# EAGLE design Cargador_RasPi3HAT_CamSlot_v1.3 (EAGLE 9.3.0)
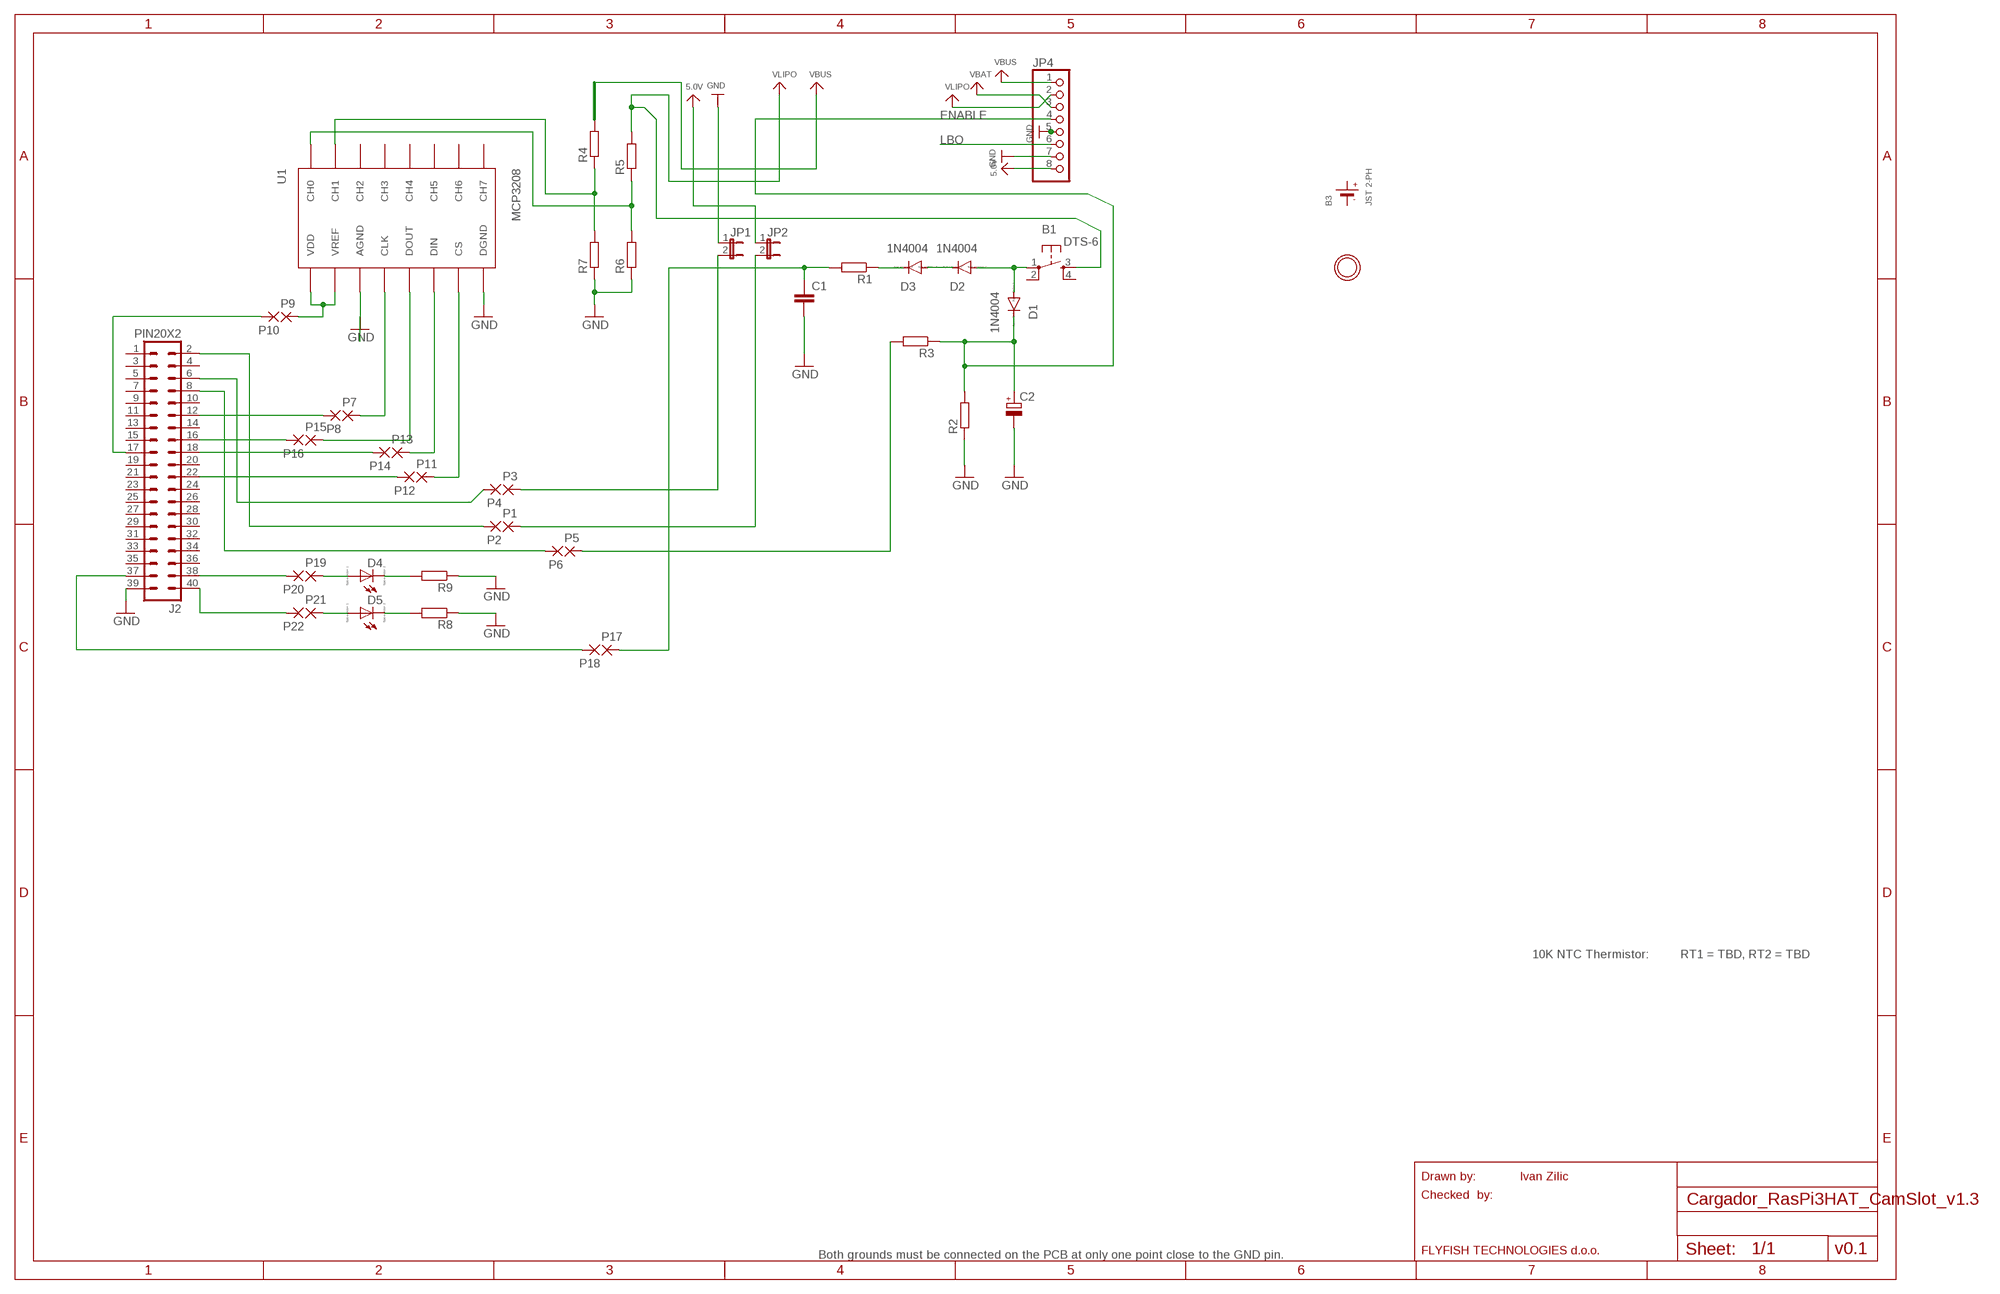
[diagram p0: schematic, sheet 1]

## Parts
B1  DTS-6  [DTS-6]
B3  JST 2-PH  BATTERY  [JSTPH2]
C1  C2.5/2  [C2.5-2]
C2  CPOL-EUE5-4  [E5-4]
D1  1N4004  [DO41-10]
D2  1N4004  [DO41-10]
D3  1N4004  [DO41-10]
D4  LED_ELD260  [LED_LD260]
D5  LED_ELD260  [LED_LD260]
J2  PIN20X2  [PIN_20X2]
JP1  JP1E  [JP1]
JP2  JP1E  [JP1]
JP4  HEADER-1X8  [1X08_OVAL]
P1  2,15/1,0  [2,15/1,0]
P2  2,15/1,0  [2,15/1,0]
P3  2,15/1,0  [2,15/1,0]
P4  2,15/1,0  [2,15/1,0]
P5  2,15/1,0  [2,15/1,0]
P6  2,15/1,0  [2,15/1,0]
P7  2,15/1,0  [2,15/1,0]
P8  2,15/1,0  [2,15/1,0]
P9  2,15/1,0  [2,15/1,0]
P10  2,15/1,0  [2,15/1,0]
P11  2,15/1,0  [2,15/1,0]
P12  2,15/1,0  [2,15/1,0]
P13  2,15/1,0  [2,15/1,0]
P14  2,15/1,0  [2,15/1,0]
P15  2,15/1,0  [2,15/1,0]
P16  2,15/1,0  [2,15/1,0]
P17  2,15/1,0  [2,15/1,0]
P18  2,15/1,0  [2,15/1,0]
P19  2,15/1,0  [2,15/1,0]
P20  2,15/1,0  [2,15/1,0]
P21  2,15/1,0  [2,15/1,0]
P22  2,15/1,0  [2,15/1,0]
R1  R-EU_0207/10  [0207/10]
R2  R-EU_0207/10  [0207/10]
R3  R-EU_0207/10  [0207/10]
R4  R-EU_0207/10  [0207/10]
R5  R-EU_0207/10  [0207/10]
R6  R-EU_0207/10  [0207/10]
R7  R-EU_0207/10  [0207/10]
R8  R-EU_0207/10  [0207/10]
R9  R-EU_0207/10  [0207/10]
U1  MCP3208  [DIL16]
U$5  MOUNTINGHOLE2.5  [MOUNTINGHOLE_2.5_PLATED]

## Nets
5.0V: JP2.1 JP4.8
ENABLE: C2.+ D1.C JP4.4 R2.2 R3.1
GND [GND]: C1.2 C2.- J2.39 JP1.1 JP4.5 JP4.7 R2.1 R6.1 R7.1 R8.1 R9.1 U1.AGND U1.DGND
LBO: JP4.6
N$1: JP1.2 P3.1(P)
N$2: P5.1(P) R3.2
N$3: D4.K(C) R9.2
N$4: D5.K(C) R8.2
N$5: D3.C R1.1
N$6: J2.40 P22.1(P)
N$7: J2.38 P20.1(P)
N$8: P11.1(P) U1.CS
N$9: P15.1(P) U1.DOUT
N$10: P13.1(P) U1.DIN
N$11 [GND]: P7.1(P) U1.CLK
N$12: J2.17 P10.1(P)
N$13 [GND]: R4.1 R7.2 U1.CH1
N$14: R5.1 R6.2 U1.CH0
N$15: J2.2 P2.1(P)
N$16: J2.6 P4.1(P)
N$17: J2.8 P6.1(P)
N$18: J2.12 P8.1(P)
N$19: P9.1(P) U1.VDD U1.VREF
N$20: JP2.2 P1.1(P)
N$21: C1.1 P17.1(P) R1.2
N$22: J2.22 P12.1(P)
N$23: D2.C D3.A
N$24 [GND]: B1.1 D1.A D2.A
N$25: J2.18 P14.1(P)
N$26: J2.16 P16.1(P)
N$27: J2.37 P18.1(P)
N$28: D4.A P19.1(P)
N$29: D5.A P21.1(P)
VBAT: JP4.3
VBUS: JP4.1 R4.2
VLIPO: B1.3 JP4.2 R5.2
Unconnected: B1.2 B1.4 B3.1(-) B3.2(+) J2.1 J2.3 J2.4 J2.5 J2.7 J2.9 J2.10 J2.11 J2.13 J2.14 J2.15 J2.19 J2.20 J2.21 J2.23 J2.24 J2.25 J2.26 J2.27 J2.28 J2.29 J2.30 J2.31 J2.32 J2.33 J2.34 J2.35 J2.36 U1.CH2 U1.CH3 U1.CH4 U1.CH5 U1.CH6 U1.CH7

## Notes on the sheet
- 10K NTC Thermistor: | RT1 = TBD, RT2 = TBD
- Drawn by: | Ivan Zilic
- Checked  by:
- Both grounds must be connected on the PCB at only one point close to the GND pin. | FLYFISH TECHNOLOGIES d.o.o. | v0.1

## Library data of the parts
B1 = switch-tact:DTS-6
B3 = microbuilder:BATTERY: CR1220 SMT - Digikey: 3001K-ND CD2032 BAT-HLD-001 - Digikey: BAT-HLD-001-ND
C1 = capacitor-wima:C: CAPACITOR naming: grid - package width
C2 = rcl:CPOL-EU: POLARIZED CAPACITOR, European symbol; SPICEPREFIX: C
D1-D3 = diode:1N4004: DIODE general purpose rectifier, 1 A
D4 D5 = eagle-ltspice:LED_E: LED Source: http://www.osram.convergy.de Source: www.luxeon.com Source: www.kingbright.com; SPICEMODEL: NONE; SPICEPREFIX: D; SPICETYPE: diode
J2 = FLYFISH:PIN20X2
JP1 JP2 = jumper:JP1E: JUMPER
JP4 = microbuilder:HEADER-1X8: PIN HEADER
P1-P22 = wirepad:2,15/1,0: THROUGH-HOLE PAD
R1-R9 = rcl:R-EU_: RESISTOR, European symbol; SPICEPREFIX: R
U1 = mcp3208:MCP3208
U$5 = microbuilder:MOUNTINGHOLE: Mounting Hole For #2 screws (0.086"/2.18mm width, 0.094"/2.4mm hole) use 2.5mm

## Net classes
1 GND: width 0.254 mm, clearance 0.381 mm

## Board
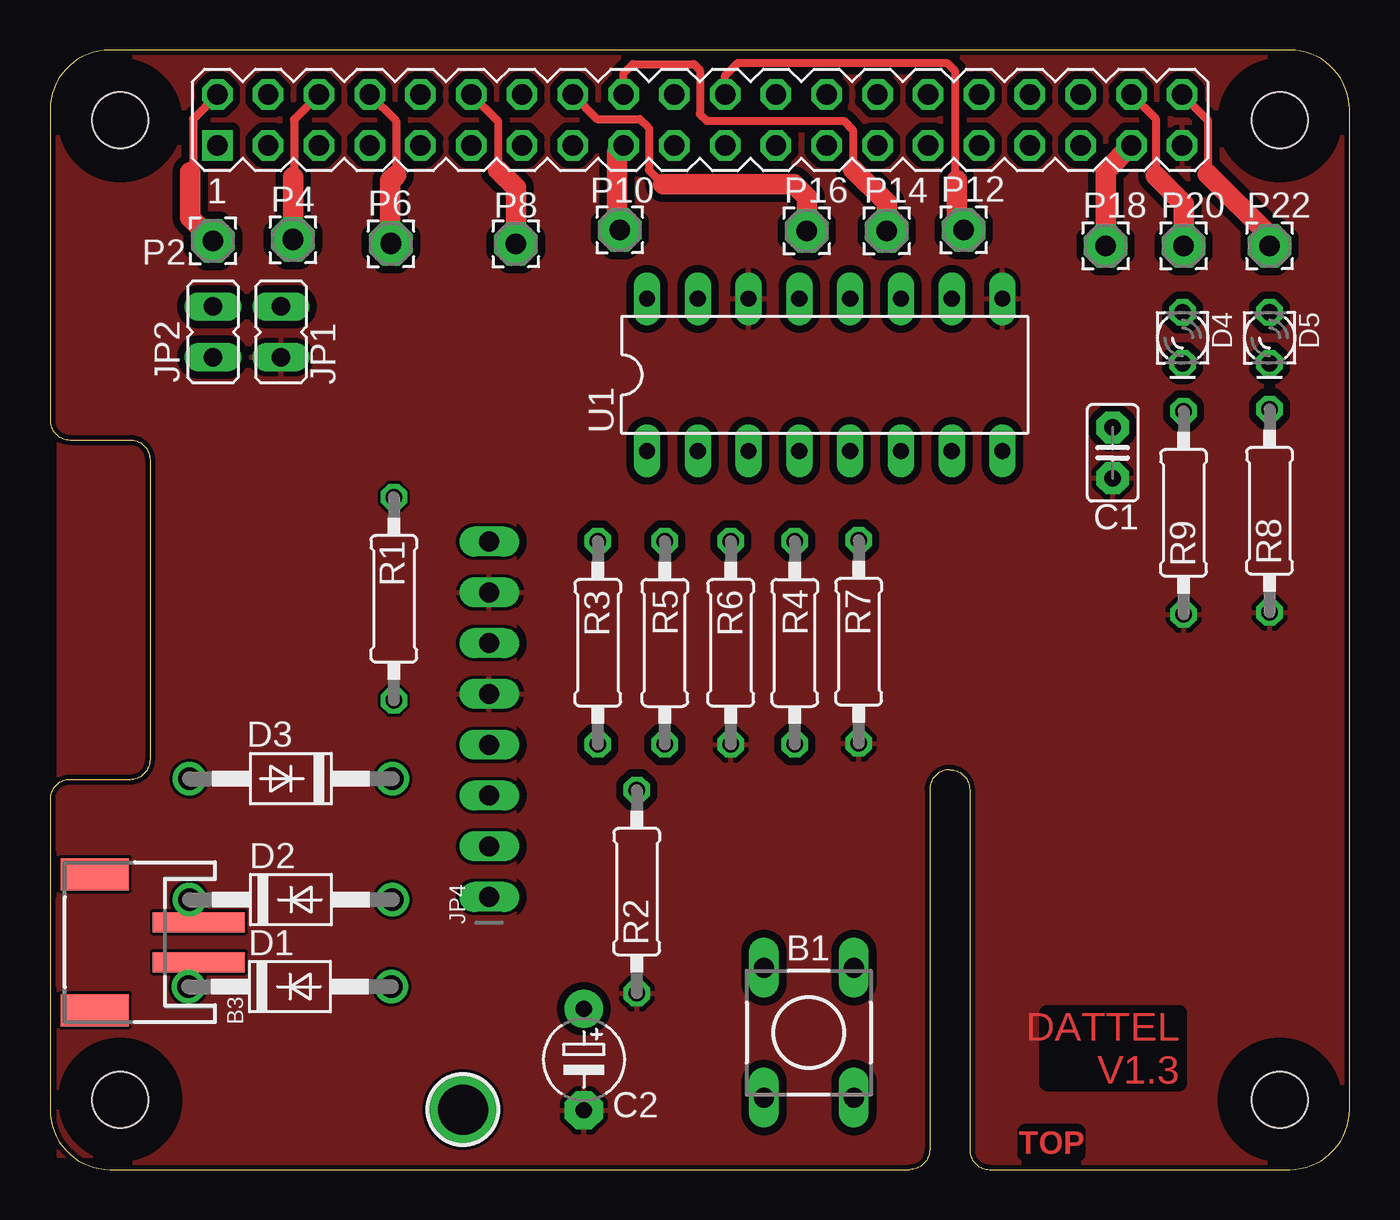
[diagram p1: board, top side]
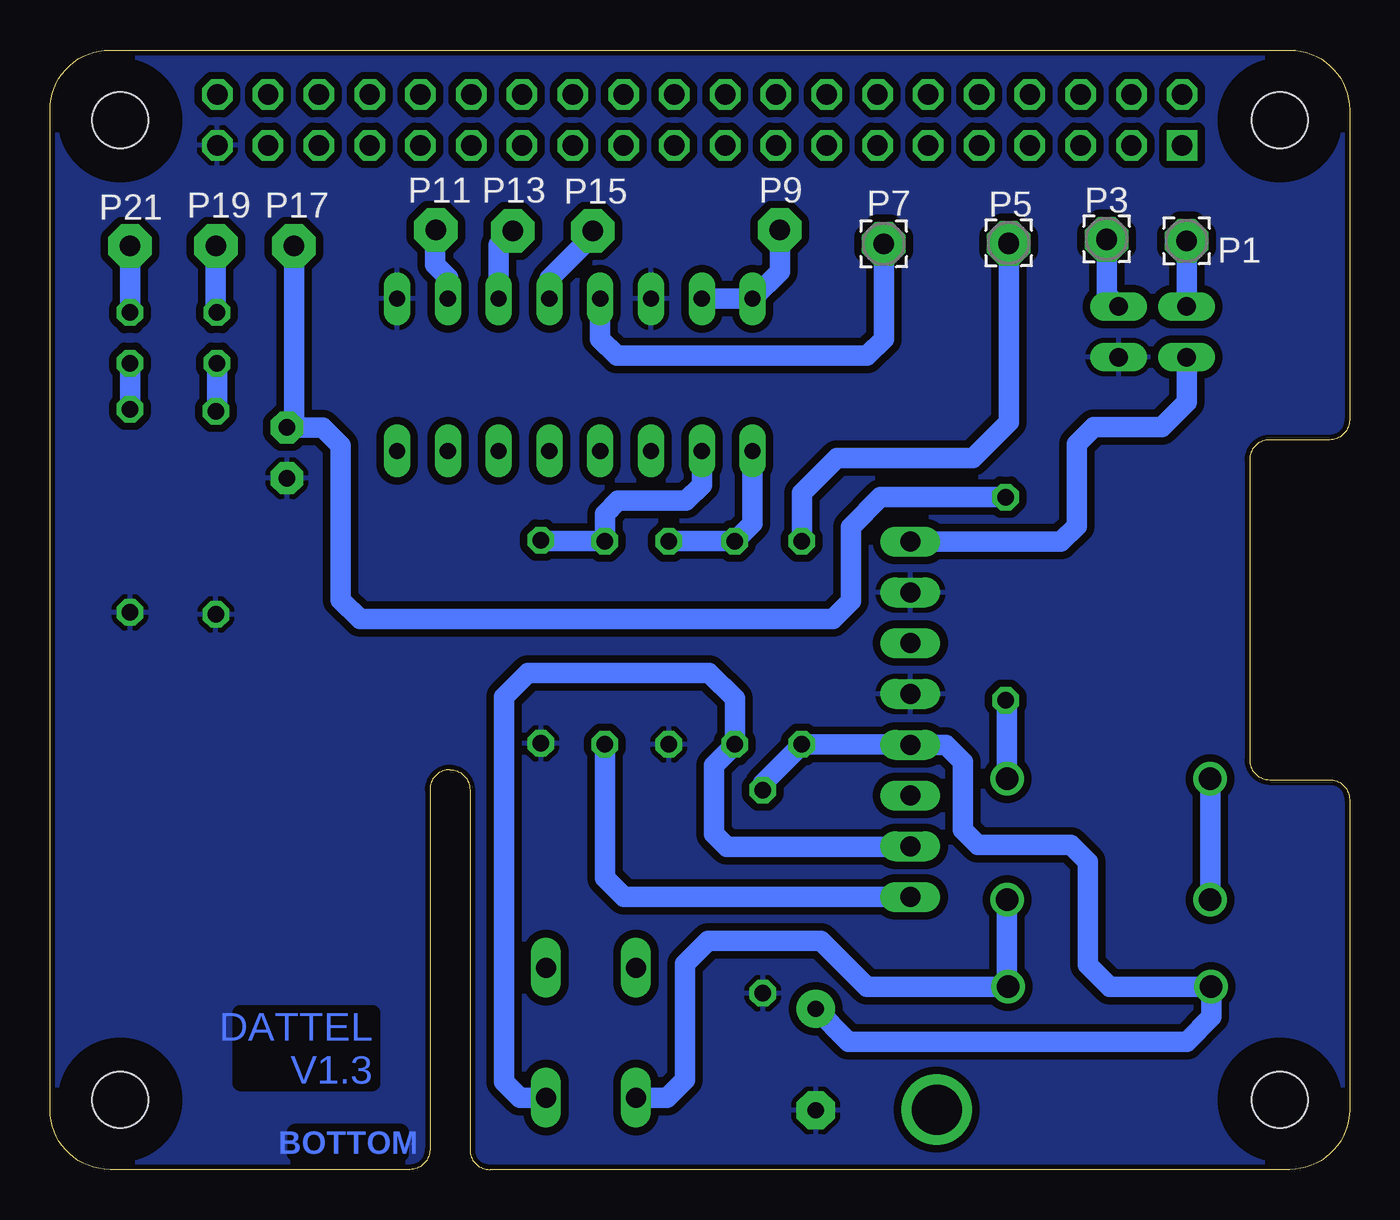
[diagram p2: board, bottom side, seen from below]

Size 65 x 56 mm. Coordinates in mm from the lower left corner, seen from the top.
Outline: 0,3 arc90 3,0 43,0 arc90 44,1 44,19 arc-90 45,20 arc-90 46,19 46,1 arc90 47,0 62,0 arc90 65,3 65,53 arc90 62,56 3,56 arc90 0,53 0,37.5 arc90 1,36.5 4,36.5 arc-90 5,35.5 5,20.5 arc-90 4,19.5 1,19.5 arc90 0,18.5 0,3
Copper layers (1*16): Top 0.035mm / dielectric 1.5mm / Bottom 0.035mm
Design rules "ITEADstudio_DRC": minimum track width 6mil, minimum drill 12mil, track to track 6mil, track to pad 6mil, pad to pad 6mil, via to via 6mil, smd to smd 0mil, copper to edge 10mil, drill to drill 10mil, minimum pad ring 10mil, minimum via ring 6mil, stop-mask expansion 2mil, vias tented up to drill 100mil, thermal gap 10mil
Holes 2.8 mm at 3.5,3.5 3.5,52.5 61.5,52.5 61.5,3.5
tRestrict: area 1.9,51 to 5,54; area 60,51 to 63,54; area 60,1.9 to 63,5; area 1.9,1.9 to 5,5
bRestrict: area 1.9,1.9 to 5,5; area 1.9,51 to 5,54; area 60,1.9 to 63,5; area 60,51 to 63,54

### Footprints (pad centres in the part's own frame; a part is rotated, then mirrored left to right if it is on the bottom)
DTS-6 = drill 1 long: 1 -3.25,2.25; 2 3.25,2.25; 3 -3.25,-2.25; 4 3.25,-2.25
JSTPH2 = smd 1 x 4.6: 1 -1,-3.7; 2 1,-3.7 | smd 1.6 x 3.4: NC1 -3.4,1.5; NC2 3.4,1.5
C2.5-2 = drill 0.813 pad 1.6 octagon: 1 -1.27,0; 2 1.27,0
E5-4 = drill 0.813 pad 1.905: + -2.54,0 | drill 0.813 pad 1.905 octagon: - 2.54,0
DO41-10 = drill 1.118: A 5.08,0; C -5.08,0
LED_LD260 = drill 0.813 octagon: A -1.27,0; K 1.27,0
PIN_20X2 = drill 1.016 square: 1 -24.13,-1.27 | drill 1.016 octagon: 2 -24.13,1.27; 3 -21.59,-1.27; 4 -21.59,1.27; 5 -19.05,-1.27; 6 -19.05,1.27; 7 -16.51,-1.27; 8 -16.51,1.27; 9 -13.97,-1.27; 10 -13.97,1.27; 11 -11.43,-1.27; 12 -11.43,1.27; 13 -8.89,-1.27; 14 -8.89,1.27; 15 -6.35,-1.27; 16 -6.35,1.27; 17 -3.81,-1.27; 18 -3.81,1.27; 19 -1.27,-1.27; 20 -1.27,1.27; 21 1.27,-1.27; 22 1.27,1.27; 23 3.81,-1.27; 24 3.81,1.27; 25 6.35,-1.27; 26 6.35,1.27; 27 8.89,-1.27; 28 8.89,1.27; 29 11.43,-1.27; 30 11.43,1.27; 31 13.97,-1.27; 32 13.97,1.27; 33 16.51,-1.27; 34 16.51,1.27; 35 19.05,-1.27; 36 19.05,1.27; 37 21.59,-1.27; 38 21.59,1.27; 39 24.13,-1.27; 40 24.13,1.27
JP1 = drill 0.914 long: 1 0,-1.27; 2 0,1.27
1X08_OVAL = drill 1 long: 1 -8.89,0; 2 -6.35,0; 3 -3.81,0; 4 -1.27,0; 5 1.27,0; 6 3.81,0; 7 6.35,0; 8 8.89,0
2,15/1,0 = drill 1.016 pad 2.159 octagon: 1 0,0
0207/10 = drill 0.813 octagon: 1 -5.08,0; 2 5.08,0
DIL16 = drill 0.813 long: AGND -3.81,3.81; CH0 -8.89,-3.81; CH1 -6.35,-3.81; CH2 -3.81,-3.81; CH3 -1.27,-3.81; CH4 1.27,-3.81; CH5 3.81,-3.81; CH6 6.35,-3.81; CH7 8.89,-3.81; CLK -1.27,3.81; CS 6.35,3.81; DGND 8.89,3.81; DIN 3.81,3.81; DOUT 1.27,3.81; VDD -8.89,3.81; VREF -6.35,3.81
MOUNTINGHOLE_2.5_PLATED = drill 2.5 pad 3.2: P$1 0,0

### Placement (x,y rotation side)
B1  37.95,6.85 90 top
B3  3.74,11.37 90 top
C1  53.15,35.85 270 top
C2  26.7,5.5 270 top
D1  12,9.15 0 top
D2  12.05,13.5 0 top
D3  12.05,19.55 180 top
D4  56.65,41.6 270 top
D5  61,41.6 270 top
J2  32.5,52.5 0 top
JP1  11.55,41.9 0 top
JP2  8.15,41.9 0 top
JP4  21.97,22.52 90 top
P1  8.15,46.45 0 top
P2  8.15,46.45 0 bottom
P3  12.15,46.5 0 top
P4  12.15,46.55 0 bottom
P5  17.05,46.3 0 top
P6  17.05,46.35 0 bottom
P7  23.3,46.3 0 top
P8  23.3,46.3 0 bottom
P9  28.5,47 0 top
P10  28.5,47 0 top
P11  45.7,47 0 top
P12  45.7,47 0 top
P13  41.85,46.95 0 top
P14  41.85,46.95 0 top
P15  37.85,46.95 0 top
P16  37.85,46.95 0 top
P17  52.8,46.2 0 top
P18  52.8,46.2 0 top
P19  56.7,46.2 0 top
P20  56.7,46.2 0 top
P21  61,46.2 0 top
P22  61,46.2 0 top
R1  17.2,28.55 90 top
R2  29.35,13.9 90 top
R3  27.4,26.35 90 top
R4  37.25,26.35 270 top
R5  30.75,26.35 270 top
R6  34.05,26.35 90 top
R7  40.45,26.4 90 top
R8  61,32.95 90 top
R9  56.7,32.85 90 top
U1  38.75,39.75 0 top
U$5  20.65,3 0 top

### Tracks (layer width: path | path; a pad name or v marks a point on that pad's centre or on a via)
5.0V
  Bottom 1.016: JP2.1 8.15,38.4 9.4,37.15 12.8,37.15 13.65,36.3 13.65,32.2 14.44,31.41 JP4.8
BOOSTER
  pour Top: 0.4,36.97 23.26,36.97 23.26,0.65 0.4,0.65
ENABLE
  Bottom 0.152: 22.03,21.27 21.99,21.23
  Bottom 0.254: 21.99,21.23 JP4.4
  Bottom 1.016: C2.+ 25.06,6.4 8.15,6.4 6.92,7.63 D1.C 12,9.15 13.1,10.25 13.1,15.4 13.95,16.25 18.6,16.25 19.35,17 19.35,20.4 20.18,21.23 21.99,21.23 | R2.2 29.35,19.32 R3.1 22.03,21.27
GND
  pour Bottom: 0,3 arc90 3,0 43,0 arc90 44,1 44,19 arc-90 45,20 arc-90 46,19 46,1 arc90 47,0 62,0 arc90 65,3 65,53 arc90 62,56 3,56 arc90 0,53 0,37.5 arc90 1,36.5 4,36.5 arc-90 5,35.5 5,20.5 arc-90 4,19.5 1,19.5 arc90 0,18.5
  pour Top: 0,3 arc90 3,0 43,0 arc90 44,1 44,19 arc-90 45,20 arc-90 46,19 46,1 arc90 47,0 62,0 arc90 65,3 65,53 arc90 62,56 3,56 arc90 0,53 0,37.5 arc90 1,36.5 4,36.5 arc-90 5,35.5 5,20.5 arc-90 4,19.5 1,19.5 arc90 0,18.5
  pour Bottom: -0.55,56.8 63.95,56.8 66.15,54.6 66.15,1.15 64.35,-0.65 1.2,-0.65 -1,1.55 -1,56.35
N$1
  Bottom 1.016: JP1.2 12.15,43.77 P3.1
N$2
  Bottom 1.016: P5.1 17.05,37.4 18.85,35.6 25.63,35.6 27.4,33.83 R3.2
N$3
  Bottom 0.152: 56.65,37.98 R9.2
  Bottom 1.016: D4.K 56.65,37.98
N$4
  Bottom 1.016: D5.K R8.2
N$5
  Bottom 1.016: R1.1 17.13,23.4 D3.C
N$6
  Top 0.406: J2.40 57.9,52.5 57.9,49.8
  Top 1.016: P22.1 61,46.7 57.9,49.8
N$7
  Top 0.406: J2.38 55.3,52.56 55.3,49.7
  Top 1.016: 55.3,49.7 56.7,48.3 P20.1
N$8
  Bottom 1.016: P11.1 45.75,46.95 45.75,45.26 45.1,44.61 U1.CS
N$9
  Bottom 1.016: P15.1 37.85,46.73 40.02,44.56 U1.DOUT
N$10
  Bottom 1.016: P13.1 42.56,46.24 U1.DIN
N$11
  Bottom 0.254: 37.5,41.55 37.48,41.57
  Bottom 1.016: P7.1 23.3,41.55 24.15,40.7 36.65,40.7 37.5,41.55 | 37.48,41.57 U1.CLK
N$12
  Top 1.016: J2.17 28.35,50.89 28.35,47.15 P10.1
N$13
  Bottom 1.016: R7.2 40.4,31.43 R4.1 37.25,32.8 36.6,33.45 33.2,33.45 32.4,34.25 U1.CH1
N$14
  Bottom 1.016: R6.2 R5.1 29.86,32.32 U1.CH0
N$15
  Top 0.254: 7.15,50.05 7,49.9
  Top 0.406: J2.2 7.15,52.55 7.15,50.05
  Top 1.016: P2.1 7,47.6 7,49.9
N$16
  Top 0.254: 12.2,49.7 12.15,49.65
  Top 0.406: J2.6 12.2,52.52 12.2,49.7
  Top 1.016: P4.1 12.15,49.65
N$17
  Top 0.406: J2.8 17.3,52.46 17.3,49.75
  Top 1.016: 17.3,49.75 17,49.45 17,46.4 P6.1
N$18
  Top 0.406: J2.12 22.4,52.44 22.4,50
  Top 1.016: 22.4,50 23.3,49.1 P8.1
N$19
  Bottom 1.016: U1.VREF U1.VDD 28.5,44.92 P9.1
N$20
  Bottom 1.016: P1.1 JP2.2
N$21
  Bottom 1.016: R1.2 23.47,33.63 24.95,32.15 24.95,28.45 25.85,27.55 49.5,27.55 50.45,28.5 50.45,36.2 51.37,37.12 C1.1 52.8,37.47 P17.1
N$22
  Top 0.406: J2.22 33.77,54.72 34.4,55.35 44.85,55.35 45.25,54.95 45.25,49.6 45.35,49.5
  Top 1.016: 45.35,49.5 45.35,47.35 P12.1
N$23
  Bottom 1.016: D2.C D3.A
N$24
  Bottom 1.016: D2.A 17.13,9.2 D1.A 24.13,9.15 26.43,11.45 32.1,11.45 33.25,10.3 33.25,4.5 34.15,3.6 B1.1
N$25
  Top 0.406: J2.18 28.69,54.84 29.15,55.3 32.2,55.3 32.5,55 32.5,52.8 32.85,52.45 39.7,52.45 40.15,52 40.15,50.05
  Top 1.016: 40.15,50.05 41.85,48.35 P14.1
N$26
  Top 0.406: J2.16 27.37,52.55 29.5,52.55 29.95,52.1 29.95,50 30.65,49.3
  Top 1.016: 30.65,49.3 37.2,49.3 37.85,48.65 P16.1
N$27
  Top 1.016: J2.37 52.8,49.94 P18.1
N$28
  Bottom 0.254: D4.A 56.7,42.92
  Bottom 1.016: 56.7,42.92 P19.1
N$29
  Bottom 1.016: D5.A P21.1
VBUS
  Bottom 1.016: JP4.1 36.28,13.63 37.25,14.6 37.25,19.99 R4.2
VLIPO
  Bottom 0.254: 21.99,16.15 JP4.2
  Bottom 1.016: 21.99,16.15 31.15,16.15 31.8,16.8 31.8,20.22 R5.2 30.75,23.57 32.03,24.85 41.1,24.85 42.3,23.65 42.3,4.4 41.5,3.6 B1.3

### Text on the board
Top: DATTEL / V1.3 | TOP
Bottom: DATTEL / V1.3 | BOTTOM